# Altium schematic sheet STM32F303RET6_.SchDoc
size A3
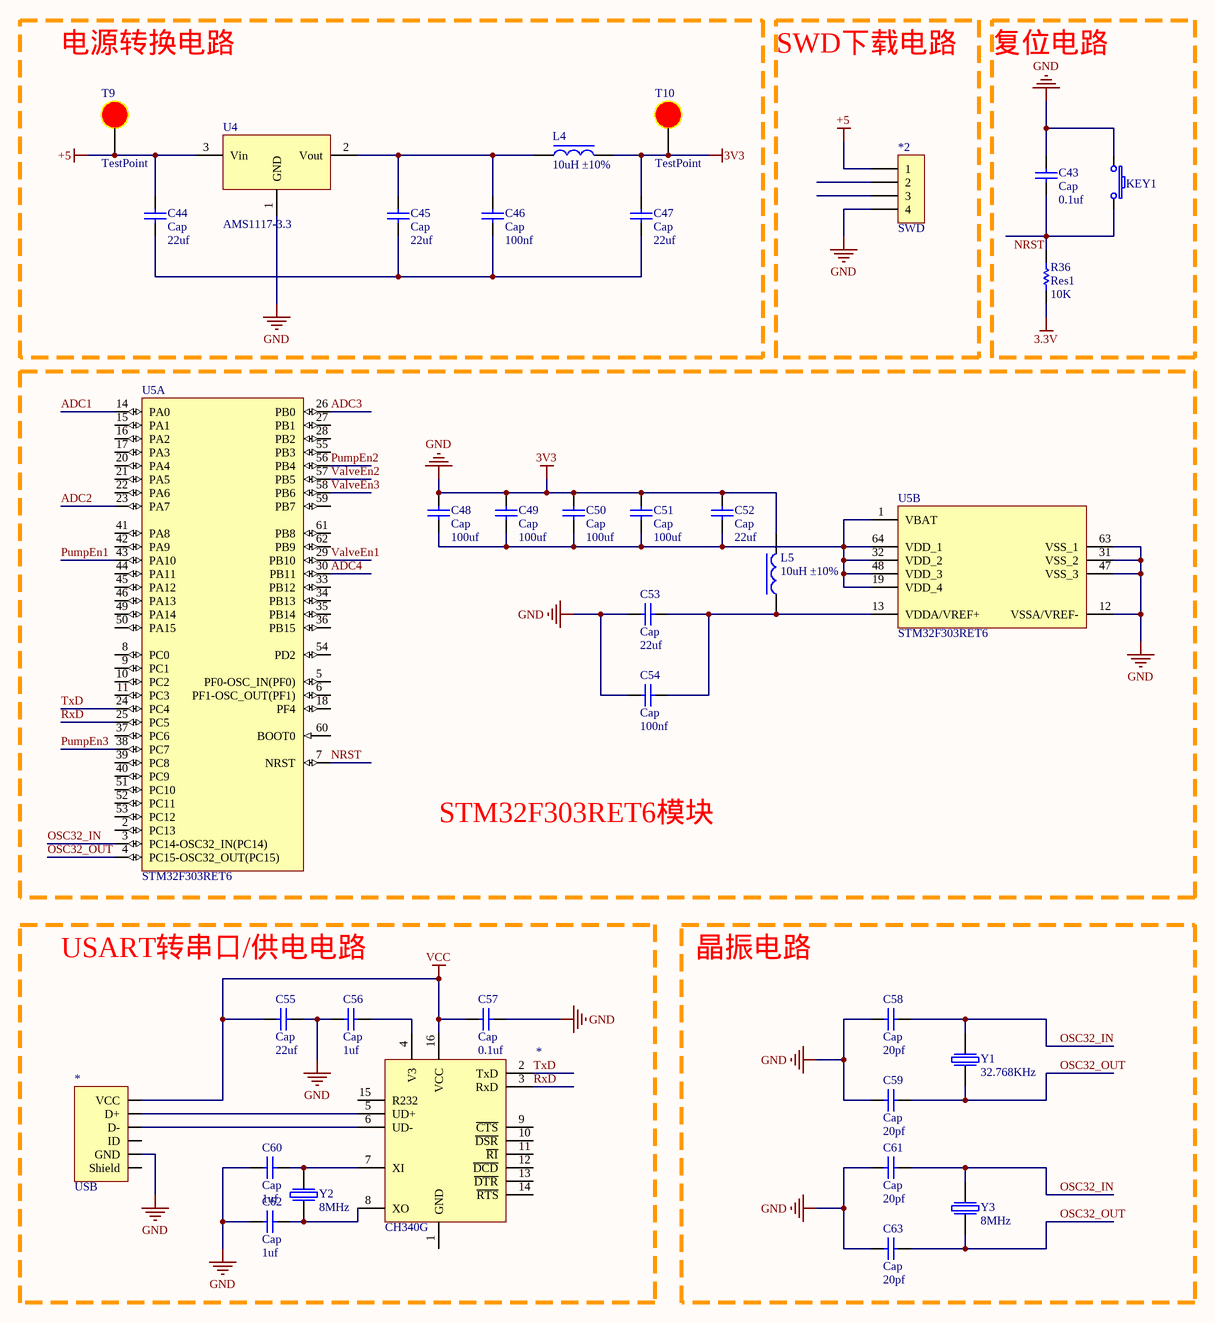
[diagram p0: STM32F303RET6_.SchDoc]

## Parts
(Parts that share a designator on the sheet are numbered #1, #2 ... from top to bottom, then left to right.)
*2  SWD
*#1  CH340G
*#2  USB
C43  Cap  value 0.1uf  [RAD-0.3]
C44  Cap  value 22uf  [RAD-0.3]
C45  Cap  value 22uf  [RAD-0.3]
C46  Cap  value 100nf  [RAD-0.3]
C47  Cap  value 22uf  [RAD-0.3]
C48  Cap  value 100uf  [RAD-0.3]
C49  Cap  value 100uf  [RAD-0.3]
C50  Cap  value 100uf  [RAD-0.3]
C51  Cap  value 100uf  [RAD-0.3]
C52  Cap  value 22uf  [RAD-0.3]
C53  Cap  value 22uf  [RAD-0.3]
C54  Cap  value 100nf  [RAD-0.3]
C55  Cap  value 22uf  [RAD-0.3]
C56  Cap  value 1uf  [RAD-0.3]
C57  Cap  value 0.1uf  [RAD-0.3]
C58  Cap  value 20pf  [RAD-0.3]
C59  Cap  value 20pf  [RAD-0.3]
C60  Cap  value 1uf  [RAD-0.3]
C61  Cap  value 20pf  [RAD-0.3]
C62  Cap  value 1uf  [RAD-0.3]
C63  Cap  value 20pf  [RAD-0.3]
KEY1  轻触开关 3.6*6.1*2.5 灰头  [TSW SMD-3.6*6.1*2.5]  (value not drawn)
L4  value 10uH ±10%  [L 0603]  (hidden comment: 10uH ±10% SMD0603)
L5  value 10uH ±10%  [L 0603]  (hidden comment: 10uH ±10% SMD0603)
R36  Res1  value 10K  [AXIAL-0.3]
T9  TestPoint  [TP_D1mm]
T10  TestPoint  [TP_D1mm]
U4  AMS1117-3.3  [SOT223_N]
U5  STM32F303RET6  [STM-LQFP64_N]  (parts A,B of 2)
Y1  value 32.768KHz  [XTAL-3215]  (hidden comment: 贴片晶振 SMD3215 32.768KHz)
Y2  value 8MHz  [XTAL-49S SMD]  (hidden comment: 贴片晶振 49SMD 8MHz)
Y3  value 8MHz  [XTAL-49S SMD]  (hidden comment: 贴片晶振 49SMD 8MHz)

## Blocks framed on the sheet
电源转换电路: C44-C47 L4 T9 T10 U4
SWD下载电路: *2
复位电路: C43 KEY1 R36
STM32F303RET6模块: C48-C54 L5 U5
USART转串口/供电电路: *#1 *#2 C55-C57 C60 C62 Y2
晶振电路: C58 C59 C61 C63 Y1 Y3

## Nets
3.3V: R36.2
3V3: *2.7(4) *#2.0(GND) C43.2 C47.1 C48.2 C49.2 C50.2 C51.2 C52.2 C53.1 C54.2 C55.2 C56.1 C57.2 C58.2 C59.2 C60.1 C61.2 C62.1 C63.2 KEY1.1 L4.2 L5.2 T10.9 U4.1(GND) U5.12(VSSA/VREF-) U5.31(VSS_2) U5.47(VSS_3) U5.63(VSS_1)  [also labelled GND]
+5: *2.4(1) C44.1 T9.9 U4.3(Vin)
VCC: *#1.16(VCC) *#2.3(VCC) C55.1 C57.1
ADC1: U5.14(PA0)
ADC2: U5.23(PA7)
ADC3: U5.26(PB0)
ADC4: U5.30(PB11)
NRST: C43.1 KEY1.2 R36.1 U5.7(NRST)
OSC32_IN: C58.1 C61.1 U5.3(PC14-OSC32_IN(PC14)) Y1.2 Y3.1
OSC32_OUT: C59.1 C63.1 U5.4(PC15-OSC32_OUT(PC15)) Y1.1 Y3.2
PumpEn1: U5.43(PA10)
PumpEn2: U5.56(PB4)
PumpEn3: U5.38(PC7)
RxD: *#1.3(RxD) U5.25(PC5)
TxD: *#1.2(TxD) U5.24(PC4)
ValveEn1: U5.29(PB10)
ValveEn2: U5.57(PB5)
ValveEn3: U5.58(PB6)
Net*#1_4: *#1.4(V3) C56.2
Net*#1_5: *#1.5(UD+) *#2.3(D+)
Net*#1_6: *#1.6(UD-) *#2.2(D-)
Net*#1_7: *#1.7(XI) C60.2 Y2.1
Net*#1_8: *#1.8(XO) C62.2 Y2.2
NetC44_2: C44.2 C45.2 C46.2 C47.2
NetC45_1: C45.1 C46.1 L4.1 U4.2(Vout)
NetC48_1: C48.1 C49.1 C50.1 C51.1 C52.1 U5.1(VBAT) U5.19(VDD_4) U5.32(VDD_2) U5.48(VDD_3) U5.64(VDD_1)
NetC53_2: C53.2 C54.1 L5.1 U5.13(VDDA/VREF+)

Not connected (* = marked no-connect by the designer): *2 5(2) 6(3); *#1 1(GND) 9(~{CTS}) 10(~{DSR}) 11(~{RI}) 12(~{DCD}) 13(~{DTR}) 14(~{RTS}) 15(R232); *#2 1(ID); U5 2(PC13) 5(PF0-OSC_IN(PF0)) 6(PF1-OSC_OUT(PF1)) 8(PC0) 9(PC1) 10(PC2) 11(PC3) 15(PA1) 16(PA2) 17(PA3) 18(PF4) 20(PA4) 21(PA5) 22(PA6) 27(PB1) 28(PB2) 33(PB12) 34(PB13) 35(PB14) 36(PB15) 37(PC6) 39(PC8) 40(PC9) 41(PA8) 42(PA9) 44(PA11) 45(PA12) 46(PA13) 49(PA14) 50(PA15) 51(PC10) 52(PC11) 53(PC12) 54(PD2) 55(PB3) 59(PB7) 60(BOOT0) 61(PB8) 62(PB9)

## Library data of the parts
C43-C63 = Cap: Capacitor; Published: 8-Jun-2000; LatestRevisionDate: 17-Jul-2002; LatestRevisionNote: Re-released for DXP Platform.; PackageReference: RAD-0.3; Publisher: Altium Limited; PackageDescription: Radial Cap, Thru-Hole; 2 Leads; 0.3 in Pin Spacing
KEY1 = 轻触开关 3.6*6.1*2.5 灰头: 贴片轻触开关，  灰头，  3.6*6.1*2.5，SMD/3.6*6.1*2.5; A.元件编号: C118141; 备注: 立创非可贴片元器件; I.焊盘数量: 2; J.品牌产地: 韩国韩荣; 单价/元（大批量）: 0.21; B.元件名称: 轻触开关 3.6*6.1*2.5 灰头; C.元件类别: 轻触开关; D.元件型号: 轻触开关 3.6*6.1*2.5 灰头; E.封装规格: SMD/3.6*6.1*2.5; F.阻值(Ω)/容值(uF): *; G.电压: *; H.精度: *; Value: *
L4 L5 = 10uH ±10% SMD0603: 贴片电感，10uH，±10%，SMD0603，Sunlord(顺络)，SDFL1608S100KTF; A.元件编号: C1035; C.元件类别: 贴片电感; E.封装规格: 0603; F.阻值(Ω)/容值(uF): 10.0000000000; I.焊盘数量: 2; 备注: 立创可贴片元器件; 单价/元（大批量）: 0.038; B.元件名称: 10uH ±10%; D.元件型号: SDFL1608S100KTF; H.精度: ±10%; J.品牌产地: Sunlord(顺络)
R36 = Res1: Resistor; Published: 8-Jun-2000; LatestRevisionDate: 17-Jul-2002; LatestRevisionNote: Re-released for DXP Platform.; PackageReference: AXIAL-0.3; Publisher: Altium Limited; PackageDescription: Axial Device, Thru-Hole; 2 Leads; 0.3 in Pin Spacing
T9 T10 = TP: 测试点
U4 = AMS1117-3.3: 低压差线性稳压(LDO)，AMS1117-3.3，1117-3.3，美国AMS，AMS1117-3.3; A.元件编号: C6186; 备注: 立创可贴片元器件; I.焊盘数量: 4; E.封装规格: SOT-223; J.品牌产地: 美国AMS; 单价/元（大批量）: 0.484; D.元件型号: AMS1117-3.3; C.元件类别: 低压差线性稳压(LDO); F.阻值(Ω)/容值(uF): 1117-3.3; Value: *; B.元件名称: AMS1117-3.3; H.精度: *; G.电压: *
U5 = STM32F303RCT6: ARM Cortex-M4 32-bit MCU, 256 KB Flash, 40 KB Internal RAM, 52 I/Os, 64-pin LQFP, -40 to 85 degC, Tray; D/A Converter: 2x12-bit (2 Channel); FLASH Size (Prog) (kB): 256; I/Os (High Current): 52; Internal RAM Size (kB): 40; Operating Frequency(F) (Processor speed) (MHz): 72; Supply Voltage(Vcc) min (V): 2; DatasheetVersion: Rev. 6; PackageVersion: Rev. 4, 06/2013; PackageReference: LQFP64; PackageDescription: 64-Pin Low Profile Quad Flat Package, 10 x 10 mm Body, 0.5 mm Pitch; Supplier 1: Digi-Key; Supplier Part Number 1: 497-13304-ND; Supplier 2: Farnell; Supplier Part Number 2: 2215112; Supplier 3: Newark; Supplier Part Number 3: 46W2193; Supplier 4: Newark; Supplier Part Number 4: 66W7288; Supplier 5: Mouser; Supplier Part Number 5: 511-STM32F303RCT6; Core: ARM Cortex-M4; Packing: Tray; Mounting Technology: Surface Mount; PartNumber: STM32F303RCT6; ComponentLink1Description: Manufacturer URL; ComponentLink1URL: http://www.st.com/web/en/home.html; ComponentLink2Description: Datasheet; ComponentLink2URL: http://www.st.com/st-web-ui/static/active/en/resource/technical/document/datasheet/DM00058181.pdf; ComponentLink3Description: Package Specification; ComponentLink3URL: http://www.st.com/st-web-ui/static/active/en/resource/technical/document/datasheet/DM00037051.pdf
Y1 = 贴片晶振 SMD3215 32.768KHz: 贴片晶振，SMD3215，32.768KHz，EPSON(爱普生)，Q13FC1350000400; 备注: 立创非可贴片元器件; B.元件名称: 32.768KHz ±20ppm 12.5pF; A.元件编号: C32346; I.焊盘数量: 2; 单价/元（大批量）: 0.65; J.品牌产地: EPSON(爱普生); E.封装规格: SMD-3215; D.元件型号: Q13FC1350000400; F.阻值(Ω)/容值(uF): *; C.元件类别: 贴片晶振; H.精度: *; G.电压: *
Y2 Y3 = 贴片晶振 49SMD 8MHz: 贴片晶振，49SMD， 8MHz，HC-49SMD，YXC; A.元件编号: C12674; 备注: 立创非可贴片元器件; B.元件名称: HC-49SMD 8MHZ 20PF 20PPM; D.元件型号: X49SM8MSD2SC; I.焊盘数量: 2; J.品牌产地: YXC; 单价/元（大批量）: 0.366; C.元件类别: 49SMD; E.封装规格: HC-49SMD; F.阻值(Ω)/容值(uF): *; G.电压: *; H.精度: *